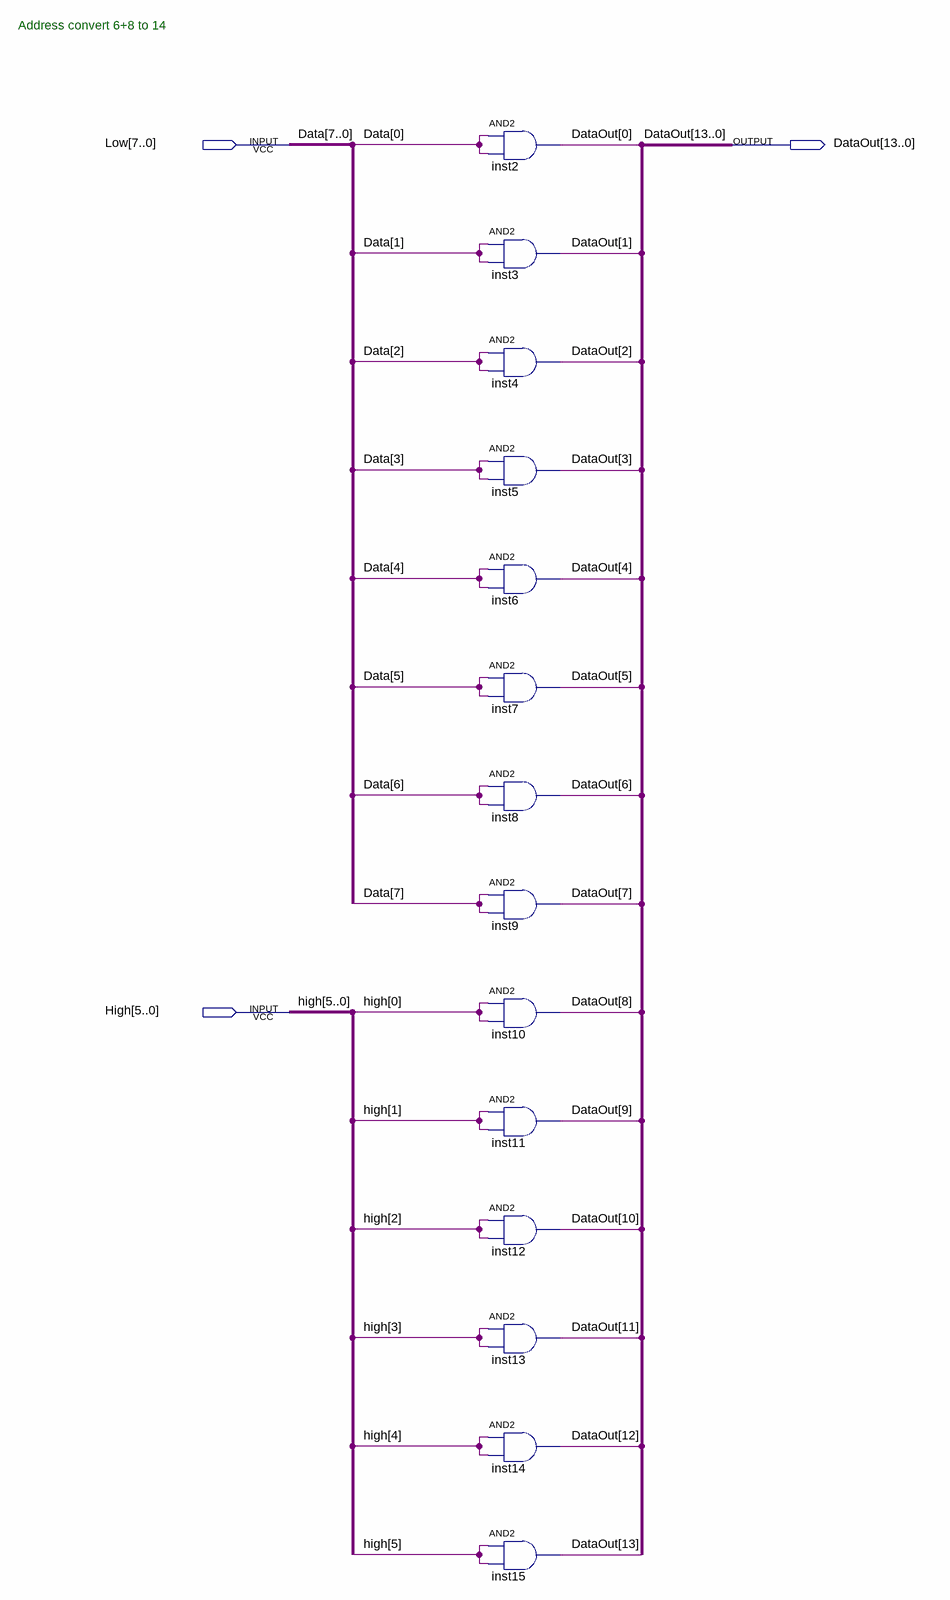
[diagram p0: schematic sheet]
// Quartus schematic 6and8to14.bdf as structural Verilog: 14 symbols, 3 pins
module \6and8to14  (
  input  [7:0] Low,
  input  [5:0] High,
  output [13:0] DataOut
);

  and inst2 (DataOut[0], Low[0], Low[0]);
  and inst3 (DataOut[1], Low[1], Low[1]);
  and inst4 (DataOut[2], Low[2], Low[2]);
  and inst5 (DataOut[3], Low[3], Low[3]);
  and inst6 (DataOut[4], Low[4], Low[4]);
  and inst7 (DataOut[5], Low[5], Low[5]);
  and inst8 (DataOut[6], Low[6], Low[6]);
  and inst9 (DataOut[7], Low[7], Low[7]);
  and inst10 (DataOut[8], High[0], High[0]);
  and inst11 (DataOut[9], High[1], High[1]);
  and inst12 (DataOut[10], High[2], High[2]);
  and inst13 (DataOut[11], High[3], High[3]);
  and inst14 (DataOut[12], High[4], High[4]);
  and inst15 (DataOut[13], High[5], High[5]);

  // Other names for the same wires on the sheet: Data[7:0] = Low

  // Notes on the sheet:
  //   Address convert 6+8 to 14
endmodule
